# EAGLE design OMHRC (EAGLE 5.11)
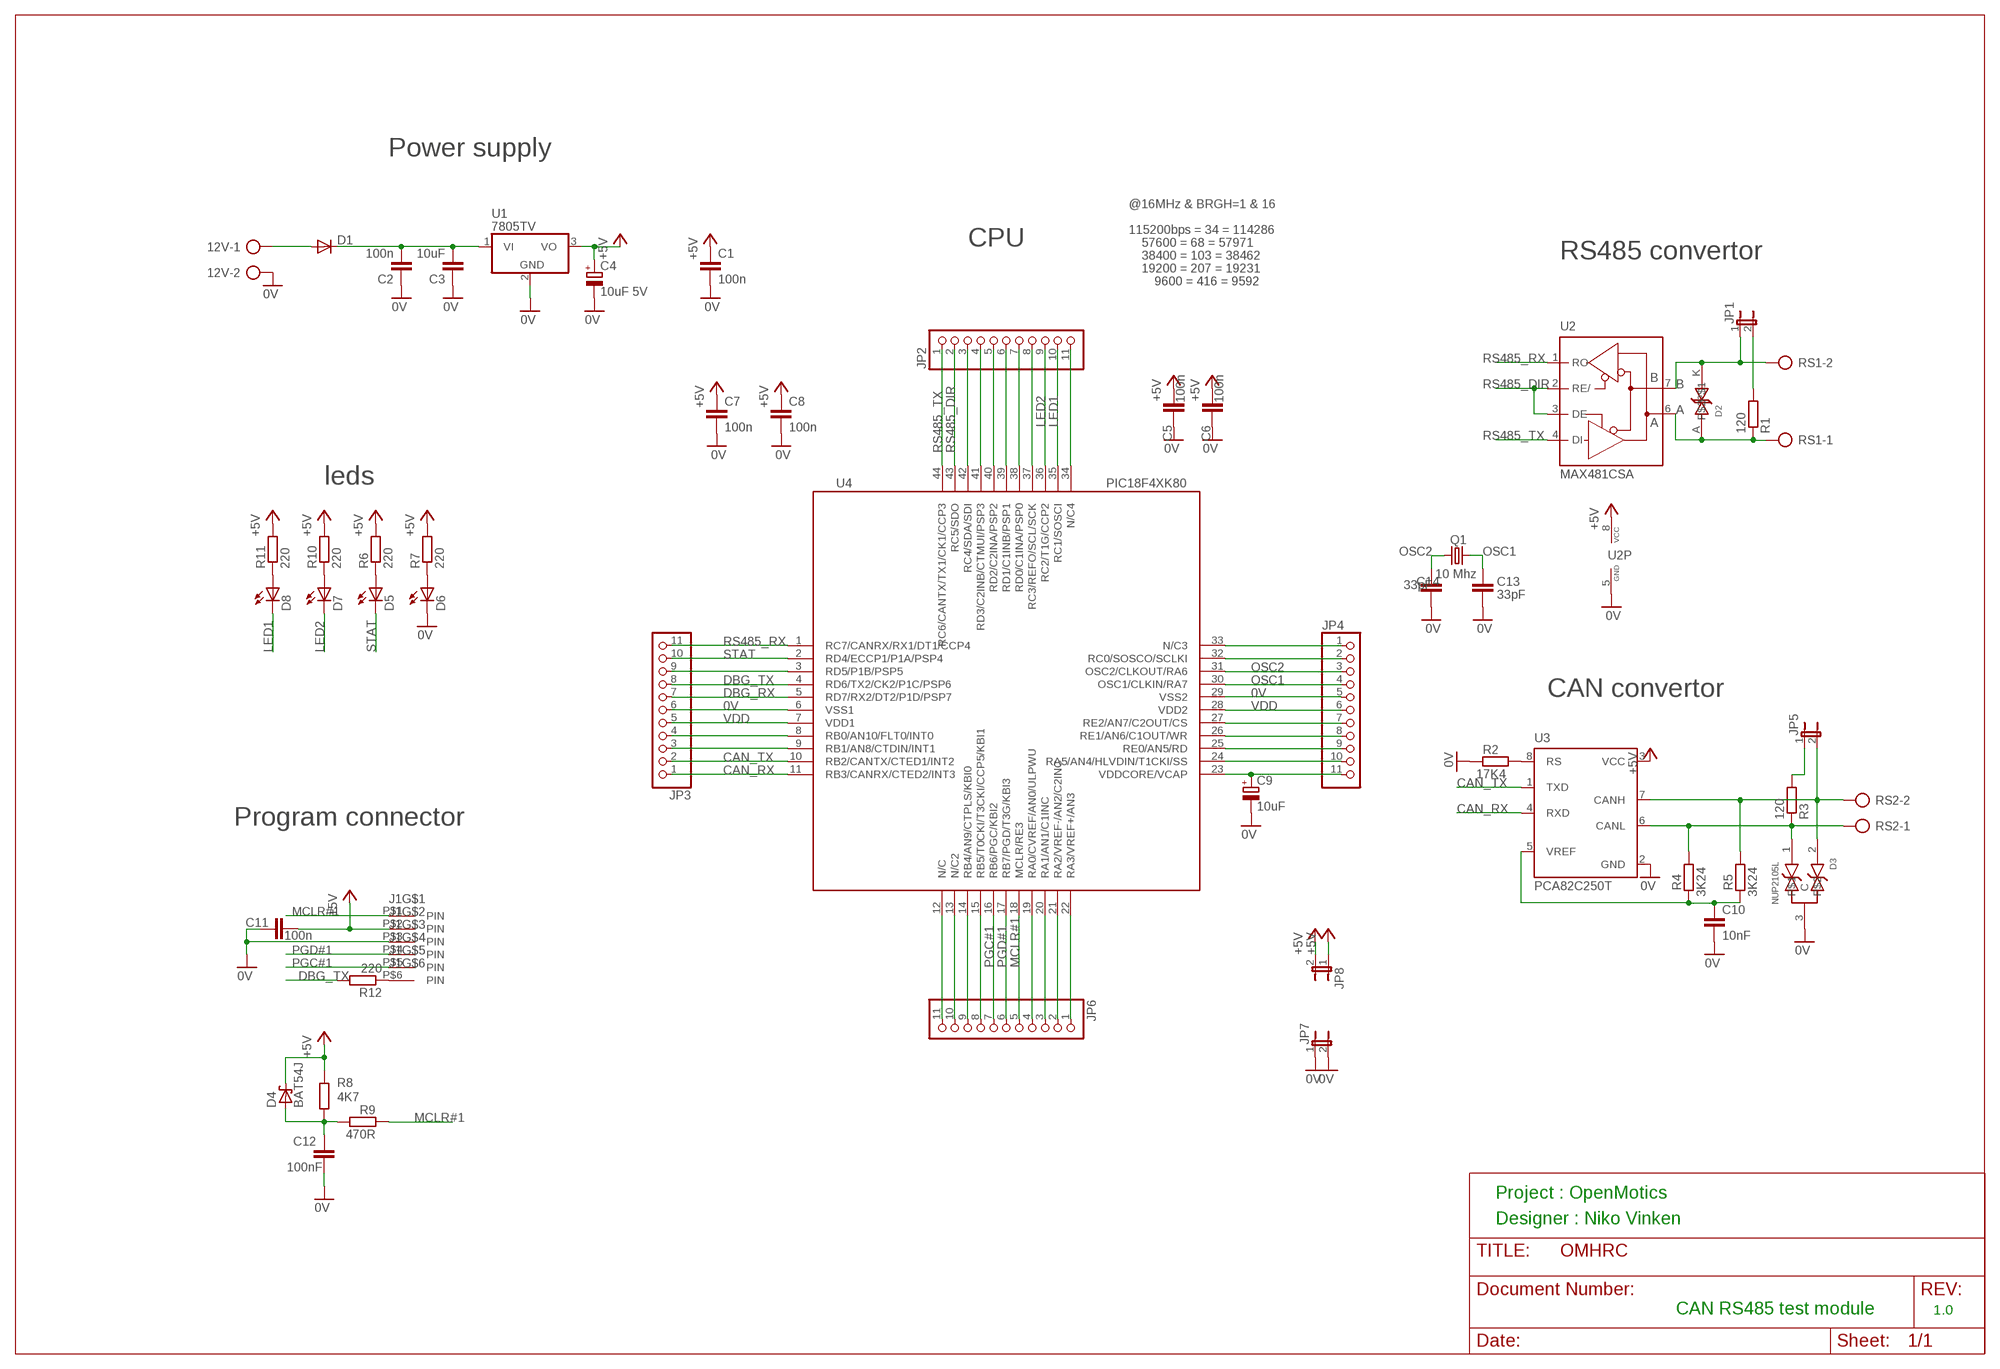
[diagram p0: schematic, sheet 1]

## Parts
12V  AK500/2  [AK500/2]
C1  100n  C-EUC0603  [C0603]
C2  100n  C-EUC0603  [C0603]
C3  10uF  C-EUC1210  [C1210]
C4  10uF 5V  CPOL-EUA/3216-18W  [A/3216-18W]
C5  100n  C-EUC0603  [C0603]
C6  100n  C-EUC0603  [C0603]
C7  100n  C-EUC0603  [C0603]
C8  100n  C-EUC0603  [C0603]
C9  10uF  CPOL-EUA/3216-18W  [A/3216-18W]
C10  10nF  C-EUC0603  [C0603]
C11  100n  C-EUC0603  [C0603]
C12  100nF  C-EUC0603  [C0603]
C13  33pF  C-EUC0603  [C0603]
C14  33pF  C-EUC0603  [C0603]
D1  DIODE-SMB  [SMB]
D2  SMAJ5.0C  [DO-214AC(SMA)]
D3  NUP2105L  [SOT23]
D4  BAT54J  [SOD323_REFLOW]
D5  LEDCHIP-LED0603  [CHIP-LED0603]
D6  LEDCHIP-LED0603  [CHIP-LED0603]
D7  LEDCHIP-LED0603  [CHIP-LED0603]
D8  LEDCHIP-LED0603  [CHIP-LED0603]
J1  6PIN_CON_AMP  [6PIN_CON_AMP]
JP1  JP1E  [JP1]
JP2  PINHD-1X11  [1X11]
JP3  PINHD-1X11  [1X11]
JP4  PINHD-1X11  [1X11]
JP5  JP1E  [JP1]
JP6  PINHD-1X11  [1X11]
JP7  JP1E  [JP1]
JP8  JP1E  [JP1]
Q1  10 Mhz  CRYSTALSM49  [SM49]
R1  120  R-EU_R0603  [R0603]
R2  17K4  R-EU_R0603  [R0603]
R3  120  R-EU_R0603  [R0603]
R4  3K24  R-EU_R0603  [R0603]
R5  3K24  R-EU_R0603  [R0603]
R6  220  R-EU_R0603  [R0603]
R7  220  R-EU_R0603  [R0603]
R8  4K7  R-EU_R0603  [R0603]
R9  470R  R-EU_R0603  [R0603]
R10  220  R-EU_R0603  [R0603]
R11  220  R-EU_R0603  [R0603]
R12  220  R-EU_R0603  [R0603]
RS1  AK500/2  [AK500/2]
RS2  AK500/2  [AK500/2]
U1  7805TV  [TO220V]
U2  MAX481CSA  [SO08]
U3  PCA82C250T  [SO8]
U4  PIC18F4XK80  [TQFP44]

## Nets
0V: 12V.2 C1.2 C2.1 C3.1 C4.- C5.2 C6.2 C7.2 C8.2 C9.- C10.2 C11.2 C12.1 C13.2 C14.2 D3.3(C) D6.C J1.P$3 JP3.6 JP4.5 JP7.1 JP7.2 R2.1 U1.2(GND) U2.5(GND) U3.2(GND) U4.6(VSS1) U4.29(VSS2)
A: D2.A R1.1 RS1.1 U2.6(A)
AAA: JP3.4 U4.8(RB0/AN10/FLT0/INT0)
B: D2.K JP1.1 RS1.2 U2.7(B)
CAN_RX: JP3.1 U3.4(RXD) U4.11(RB3/CANRX/CTED2/INT3)
CAN_TX: JP3.2 U3.1(TXD) U4.10(RB2/CANTX/CTED1/INT2)
DBG_RX: JP3.7 U4.5(RD7/RX2/DT2/P1D/PSP7)
DBG_TX: JP3.8 R12.2 U4.4(RD6/TX2/CK2/P1C/PSP6)
GFVV: JP4.8 U4.26(RE1/AN6/C1OUT/WR)
IN1: JP4.7 U4.27(RE2/AN7/C2OUT/CS)
IN2: JP2.6 U4.39(RD1/C1INB/PSP1)
IN3: JP4.2 U4.32(RC0/SOSCO/SCLKI)
IN4: JP2.7 U4.38(RD0/C1INA/PSP0)
IN5: JP6.8 U4.15(RB5/T0CKI/T3CKI/CCP5/KBI1)
IN6: JP3.9 U4.3(RD5/P1B/PSP5)
INTR: JP3.3 U4.9(RB1/AN8/CTDIN/INT1)
LED1: D8.C JP2.10 U4.35(RC1/SOSCI)
LED2: D7.C JP2.9 U4.36(RC2/T1G/CCP2)
MCLR#1: J1.P$1 JP6.5 R9.1 U4.18(MCLR/RE3)
N$1: JP2.11 U4.34(N/C4)
N$2: D7.A R10.1
N$3: C12.2 D4.2 R8.1 R9.2
N$4: JP6.1 U4.22(RA3/VREF+/AN3)
N$5: JP6.2 U4.21(RA2/VREF-/AN2/C2INC)
N$6: C2.2 C3.2 D1.C U1.1(VI)
N$7: D5.A R6.1
N$8: D6.A R7.1
N$9: 12V.1 D1.A
N$10: JP6.3 U4.20(RA1/AN1/C1INC)
N$11: JP6.4 U4.19(RA0/CVREF/AN0/ULPWU)
N$12: JP6.9 U4.14(RB4/AN9/CTPLS/KBI0)
N$13: JP6.10 U4.13(N/C2)
N$14: JP6.11 U4.12(N/C)
N$15: JP1.2 R1.2
N$16: JP4.1 U4.33(N/C3)
N$17: D3.2 JP5.2 R5.2 RS2.2 U3.7(CANH)
N$18: D3.1 R3.1 R4.2 RS2.1 U3.6(CANL)
N$19: JP4.10 U4.24(RA5/AN4/HLVDIN/T1CKI/SS)
N$20: JP5.1 R3.2
N$21: D8.A R11.1
N$22: R2.2 U3.8(RS)
N$23: J1.P$6 R12.1
N$33: C9.+ JP4.11 U4.23(VDDCORE/VCAP)
N$56: C10.1 R4.1 R5.1 U3.5(VREF)
OSC1: C13.1 JP4.4 Q1.1 U4.30(OSC1/CLKIN/RA7)
OSC2: C14.1 JP4.3 Q1.2 U4.31(OSC2/CLKOUT/RA6)
OUT2: JP2.5 U4.40(RD2/C2INA/PSP2)
OUT3: JP4.9 U4.25(RE0/AN5/RD)
OUT4: JP2.4 U4.41(RD3/C2INB/CTMUI/PSP3)
PGC#1: J1.P$5 JP6.7 U4.16(RB6/PGC/KBI2)
PGD#1: J1.P$4 JP6.6 U4.17(RB7/PGD/T3G/KBI3)
RS485_DIR: JP2.2 U2.2(RE/) U2.3(DE) U4.43(RC5/SDO)
RS485_RX: JP3.11 U2.1(RO) U4.1(RC7/CANRX/RX1/DT1/CCP4)
RS485_TX: JP2.1 U2.4(DI) U4.44(RC6/CANTX/TX1/CK1/CCP3)
SCL: JP2.8 U4.37(RC3/REFO/SCL/SCK)
SDA: JP2.3 U4.42(RC4/SDA/SDI)
STAT: D5.C JP3.10 U4.2(RD4/ECCP1/P1A/PSP4)
VDD: C1.1 C4.+ C5.1 C6.1 C7.1 C8.1 C11.1 D4.1 J1.P$2 JP3.5 JP4.6 JP8.1 JP8.2 R6.2 R7.2 R8.2 R10.2 R11.2 U1.3(VO) U2.8(VCC) U3.3(VCC) U4.7(VDD1) U4.28(VDD2) ; supply symbol labelled +5V

## Notes on the sheet
- Power supply
- @16MHz & BRGH=1 & 16
- 115200bps = 34 = 114286
- CPU | 57600 = 68 = 57971
- 38400 = 103 = 38462 | RS485 convertor
- 19200 = 207 = 19231
- 9600 = 416 = 9592
- leds
- CAN convertor
- Program connector
- Project : OpenMotics
- Designer : Niko Vinken
- CAN RS485 test module | 1.0

## Library data of the parts
12V RS1 RS2 = con-ptr500:AK500/2: CONNECTOR
C1-C3 C5-C8 C10-C14 = resistor:C-EU: CAPACITOR, European symbol
C4 C9 = resistor:CPOL-EU: POLARIZED CAPACITOR, European symbol
D1 = diode:DIODE-: DIODE
D2 = racktivity:SMAJ5.0C
D3 = OpenMotics:NUP2105L
D4 = racktivity:BAT54J
D5-D8 = led:LED: LED OSRAM: - CHIPLED LG R971, LG N971, LY N971, LG Q971, LY Q971, LO R971, LY R971 LH N974, LH R974 LS Q976, LO Q976, LY Q976 LO Q996 - Hyper CHIPLED LW Q18S LB Q993, LB Q99A, LB R99A - SideLED LS A670, LO A670, LY A670, LG A670, LP A670 LB A673, LV A673, LT A673, LW A673 LH A674 LY A675 LS A676, LA A676, LO A676, LY A676, LW A676 LS A679, LY A679, LG A679 - Hyper Micro SIDELED® LS Y876, LA Y876, LO Y876, LY Y876 LT Y87S - SmartLED LW L88C, LW L88S LB L89C, LB L89S, LG L890 LS L89K, LO L89K, LY L89K LS L896, LA L896, LO L896, LY L896 - TOPLED LS T670, LO T670, LY T670, LG T670, LP T670 LSG T670, LSP T670, LSY T670, LOP T670, LYG T670 LG T671, LOG T671, LSG T671 LB T673, LV T673, LT T673, LW T673 LH T674 LS T676, LA T676, LO T676, LY T676, LB T676, LH T676, LSB T676, LW T676 LB T67C, LV T67C, LT T67C, LS T67K, LO T67K, LY T67K, LW E67C LS E67B, LA E67B, LO E67B, LY E67B, LB E67C, LV E67C, LT E67C LW T67C LS T679, LY T679, LG T679 LS T770, LO T770, LY T770, LG T770, LP T770 LB T773, LV T773, LT T773, LW T773 LH T774 LS E675, LA E675, LY E675, LS T675 LS T776, LA T776, LO T776, LY T776, LB T776 LHGB T686 LT T68C, LB T68C - Hyper Mini TOPLED® LB M676 - Mini TOPLED Santana® LG M470 LS M47K, LO M47K, LY M47K Source: http://www.osram.convergy.de LUXEON: - LUMILED® LXK2-PW12-R00, LXK2-PW12-S00, LXK2-PW14-U00, LXK2-PW14-V00 LXK2-PM12-R00, LXK2-PM12-S00, LXK2-PM14-U00 LXK2-PE12-Q00, LXK2-PE12-R00, LXK2-PE12-S00, LXK2-PE14-T00, LXK2-PE14-U00 LXK2-PB12-K00, LXK2-PB12-L00, LXK2-PB12-M00, LXK2-PB14-N00, LXK2-PB14-P00, LXK2-PB14-Q00 LXK2-PR12-L00, LXK2-PR12-M00, LXK2-PR14-Q00, LXK2-PR14-R00 LXK2-PD12-Q00, LXK2-PD12-R00, LXK2-PD12-S00 LXK2-PH12-R00, LXK2-PH12-S00 LXK2-PL12-P00, LXK2-PL12-Q00, LXK2-PL12-R00 Source: www.luxeon.com KINGBRIGHT: KA-3528ASYC Source: www.kingbright.com
J1 = OpenMotics:6PIN_CON_AMP
JP1 JP5 JP7 JP8 = jumper:JP1E: JUMPER
JP2-JP4 JP6 = pinhead:PINHD-1X11: PIN HEADER
Q1 = crystal:CRYSTAL: CRYSTAL
R1 R3 R6-R12 = resistor:R-EU_: RESISTOR, European symbol
R2 R4 R5 = rcl:R-EU_: RESISTOR, European symbol
U1 = linear:78*: Positive VOLTAGE REGULATOR Source: http://cache.national.com/ds/LM/LM78L05.pdf http://www.fairchildsemi.com/ds/LM/LM7805.pdf
U2 = maxim:MAX481CSA: RS485 TRANSEIVER
U3 = micro-philips:PCA82C250: CAN CONTROLLER INTERFACE; OC_FARNELL: 1085275; OC_NEWARK: unknown
U4 = OpenMotics:PIC18F4XK80

## Board
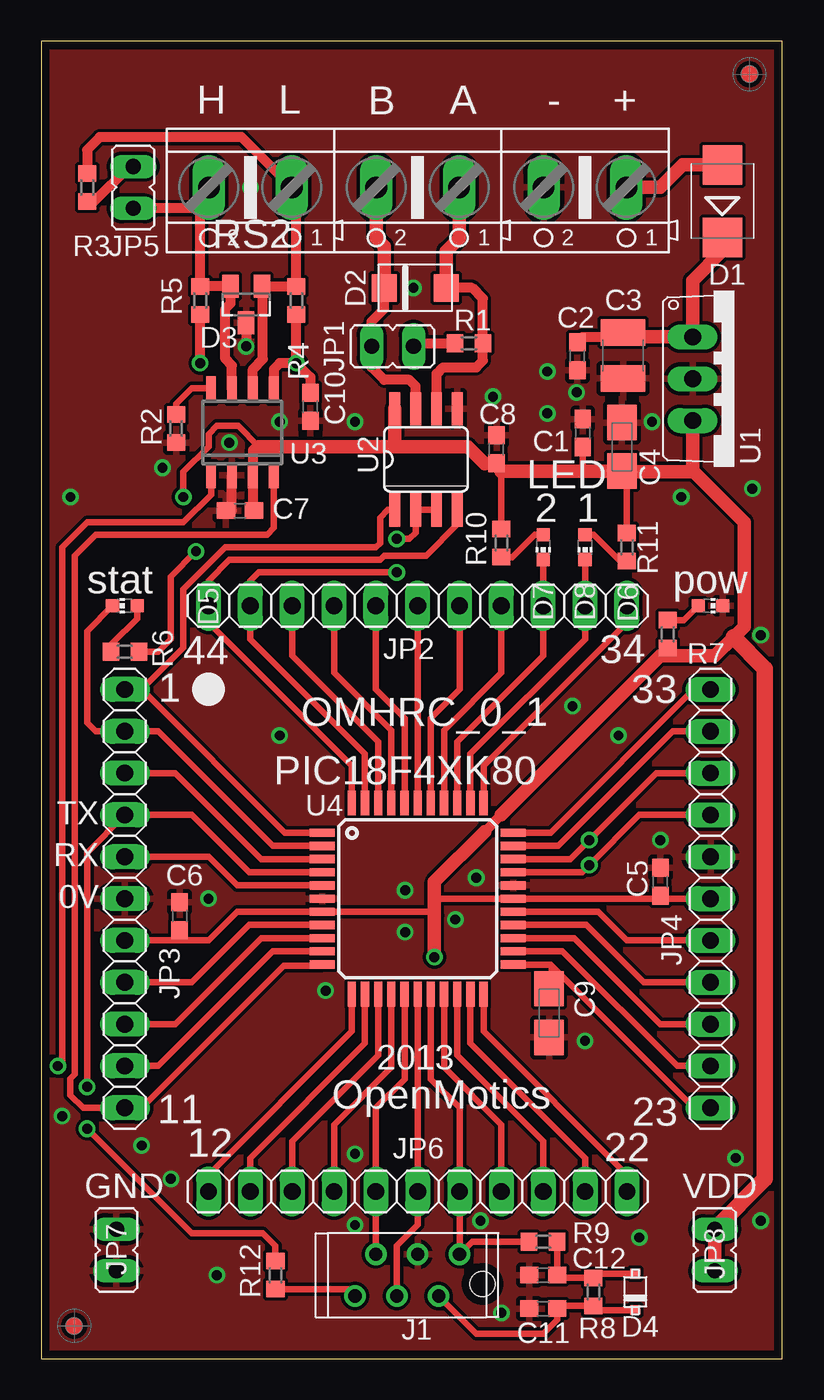
[diagram p1: board, top side]
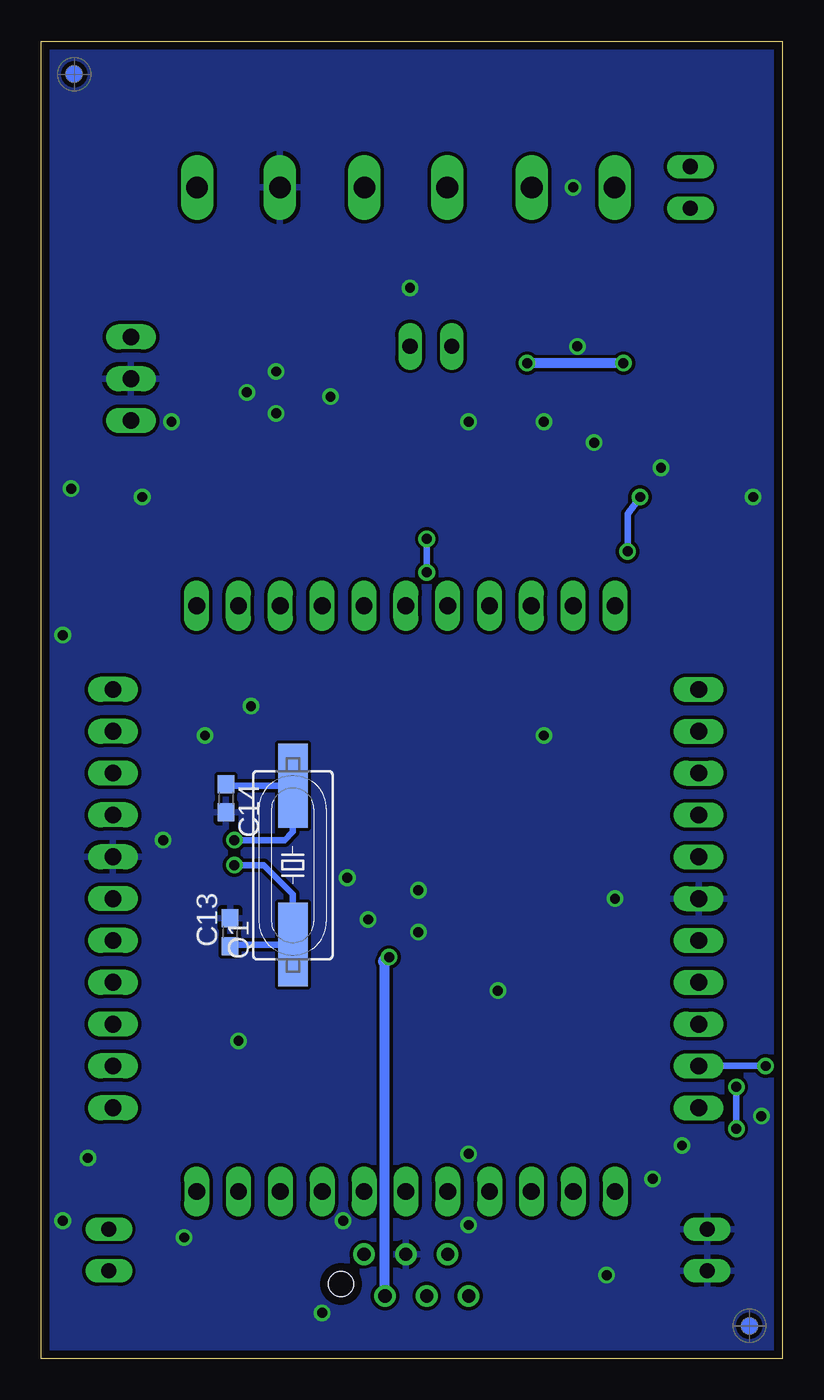
[diagram p2: board, bottom side, seen from below]

Size 45 x 80 mm. Coordinates in mm from the lower left corner, seen from the top.
Outline: 45,0 45,80 0,80 0,0 45,0
Copper layers (1+16): Top 0.035mm / dielectric 1.5mm / Bottom 0.035mm
Design rules "default *": minimum track width 10mil, minimum drill 24mil, track to track 8mil, track to pad 8mil, pad to pad 8mil, via to via 8mil, smd to smd 8mil, copper to edge 20mil, drill to drill 8mil, minimum pad ring 10mil, minimum via ring 8mil, stop-mask expansion 4mil, vias tented up to drill 0mil, thermal gap 10mil

### Footprints (pad centres in the part's own frame; a part is rotated, then mirrored left to right if it is on the bottom)
AK500/2 = drill 1.321 long: 1 -2.515,0; 2 2.515,0
C0603 = smd 1.1 x 1: 1 -0.85,0; 2 0.85,0
C1210 = smd 1.6 x 2.7: 1 -1.4,0; 2 1.4,0
A/3216-18W = smd 2.15 x 1.8: + 1.475,0; - -1.475,0
SMB = smd 2.4 x 2.4: A 2.2,0; C -2.2,0
DO-214AC(SMA) = smd 1.524 x 1.676: A 3.759,0; K 0,0
SOT23 = smd 1 x 1.4: 1 -0.95,-1.1; 2 0.95,-1.1; 3 0,1.1
SOD323_REFLOW = smd 0.6 x 0.6: 1 1.1,0; 2 -1.1,0
CHIP-LED0603 = smd 0.8 x 0.8: A 0,-0.75; C 0,0.75
6PIN_CON_AMP = drill 0.8 round: P$1 0,-1.27; P$2 1.27,1.27; P$3 2.54,-1.27; P$4 3.81,1.27; P$5 5.08,-1.27; P$6 6.35,1.27 | hole 1.5: -1.4,0.53
JP1 = drill 0.914 long: 1 0,-1.27; 2 0,1.27
1X11 = drill 1.016 long: 1 -12.7,0; 2 -10.16,0; 3 -7.62,0; 4 -5.08,0; 5 -2.54,0; 6 0,0; 7 2.54,0; 8 5.08,0; 9 7.62,0; 10 10.16,0; 11 12.7,0
SM49 = smd 5.08 x 1.778: 1 -4.826,0; 2 4.826,0
R0603 = smd 1 x 1.1: 1 -0.85,0; 2 0.85,0
TO220V = drill 1.016 long: 1 -2.54,-2.54; 2 0,-2.54; 3 2.54,-2.54
SO08 = smd 0.66 x 2.032: 1 -1.905,-3.073; 2 -0.635,-3.073; 3 0.635,-3.073; 4 1.905,-3.073; 5 1.905,3.073; 6 0.635,3.073; 7 -0.635,3.073; 8 -1.905,3.073
SO8 = smd 0.6 x 1.6: 1 -1.905,-2.6; 2 -0.635,-2.6; 3 0.635,-2.6; 4 1.905,-2.6; 5 1.905,2.6; 6 0.635,2.6; 7 -0.635,2.6; 8 -1.905,2.6
TQFP44 = smd 1.5 x 0.5: 1 -5.8,4; 2 -5.8,3.2; 3 -5.8,2.4; 4 -5.8,1.6; 5 -5.8,0.8; 6 -5.8,0; 7 -5.8,-0.8; 8 -5.8,-1.6; 9 -5.8,-2.4; 10 -5.8,-3.2; 11 -5.8,-4; 23 5.8,-4; 24 5.8,-3.2; 25 5.8,-2.4; 26 5.8,-1.6; 27 5.8,-0.8; 28 5.8,0; 29 5.8,0.8; 30 5.8,1.6; 31 5.8,2.4; 32 5.8,3.2; 33 5.8,4 | smd 0.5 x 1.5: 12 -4,-5.8; 13 -3.2,-5.8; 14 -2.4,-5.8; 15 -1.6,-5.8; 16 -0.8,-5.8; 17 0,-5.8; 18 0.8,-5.8; 19 1.6,-5.8; 20 2.4,-5.8; 21 3.2,-5.8; 22 4,-5.8; 34 4,5.8; 35 3.2,5.8; 36 2.4,5.8; 37 1.6,5.8; 38 0.8,5.8; 39 0,5.8; 40 -0.8,5.8; 41 -1.6,5.8; 42 -2.4,5.8; 43 -3.2,5.8; 44 -4,5.8

### Placement (x,y rotation side)
12V  33.02,71.12 180 top
C1  32.88,56.21 90 top
C2  32.55,60.88 90 top
C3  35.33,60.92 90 top
C4  35.26,55.37 270 top
C5  37.59,28.96 90 top
C6  8.41,26.88 90 top
C7  12.07,51.5 180 top
C8  27.65,55.22 90 top
C9  30.84,20.99 90 top
C10  16.34,57.81 270 top
C11  30.48,3.05 180 top
C12  30.48,5.08 0 top
C13  33.53,25.91 90 bottom
C14  33.78,34.04 270 bottom
D1  41.36,70.29 90 top
D2  20.83,65.02 0 top
D3  12.45,64.01 180 top
D4  36.07,4.06 270 top
D5  5.08,45.72 90 top
D6  40.64,45.72 270 top
D7  30.48,49.28 180 top
D8  33.02,49.28 180 top
J1  25.4,5.08 180 top
JP1  21.34,61.47 270 top
JP2  22.86,45.72 0 top
JP3  5.08,27.94 90 top
JP4  40.64,27.94 270 top
JP5  5.59,71.12 180 top
JP6  22.86,10.16 180 top
JP7  4.57,6.6 0 top
JP8  40.89,6.6 0 top
Q1  29.72,29.97 90 bottom
R1  25.97,61.66 180 top
R2  8.19,56.48 90 top
R3  2.79,71.12 270 top
R4  15.49,64.26 90 top
R5  9.65,64.26 90 top
R6  5.08,42.93 0 top
R7  38.04,44 270 top
R8  33.53,4.06 270 top
R9  30.48,7.11 0 top
R10  27.94,49.53 90 top
R11  35.56,49.28 90 top
R12  14.22,5.08 90 top
RS1  22.86,71.12 180 top
RS2  12.7,71.12 180 top
U1  42.09,59.5 270 top
U2  23.37,54.61 0 top
U3  12.22,56.25 0 top
U4  22.86,27.94 0 top
U$1  [FIDUCIAL_G10]  43,78 0 top
U$2  [FIDUCIAL_G10]  2,2 0 top
U$3  [FIDUCIAL_G10]  2,2 0 bottom
U$12  [FIDUCIAL_G10]  43,78 0 bottom

### Tracks (layer width: path | path; a pad name or v marks a point on that pad's centre or on a via)
0V  (via drill 0.6)
  Top 0.406: C6.2 8.43,27.73 8.64,27.94
  Top 0.61: D3.3 v12.45,61.47 | U3.2 11.58,51.49 C7.2
  Top 0.813: 35.26,59.46 C3.1 35.34,59.5
  other vias: 14.48,56.9 7.37,54.1 27.43,58.42 30.73,59.94 30.73,57.4 32.51,58.67 37.08,56.9 38.86,52.32 37.59,31.5 22.1,28.45 22.1,25.91 25.15,26.67 26.42,29.21 33.02,19.3 10.16,27.94 27.94,2.79 1.27,14.73 14.48,37.85 11.43,55.63 26.67,8.38 19.05,8.13 19.05,12.45 43.18,52.83 43.69,43.94 35.05,37.85 32.26,39.62 6.1,12.95 7.87,10.92 42.16,12.19 43.69,8.38 36.32,7.37 10.67,5.08 17.27,22.35 1.78,52.32 12.7,71.12 22.61,65.02 19.05,56.9
  pour Top: 0,0 0,80.01 45.21,80.01 45.21,0
  pour Bottom: 0,0 0,80.01 45.21,80.01 45.21,0
A
  Top 0.61: U2.6 24,59.82 24.38,60.2 26.42,60.2 26.82,60.6 R1.1 26.82,64.37 26.16,65.02 D2.A
  Top 0.813: RS1.1 25.38,68.05 24.59,67.26 D2.A
AAA
  Top 0.406: U4.8 12.62,26.34 9.14,22.86 JP3.4
B
  Top 0.61: D2.K 20.83,63.75 20.07,62.99 JP1.1 20.07,60.2 20.83,59.44 22.35,59.44 22.73,59.05 U2.7
  Top 0.813: RS1.2 20.34,68.05 20.83,67.56 D2.K
CAN_RX
  Top 0.406: U4.11 17,23.88 14.73,23.88 6.1,15.24 JP3.1 2.54,15.24 1.78,16 1.78,17.02 2.03,17.27 2.03,48.77 3.3,50.04 13.72,50.04 14.12,50.44 U3.4
CAN_TX  (via drill 0.6)
  Top 0.406: U4.10 14.07,24.74 7.11,17.78 JP3.2 | U3.1 10.31,52.48 8.64,50.8 2.79,50.8 1.27,49.28 1.27,18.03 v1.02,17.78
  Bottom 0.406: v1.02,17.78 JP3.2
DBG_RX
  Top 0.406: U4.5 11.9,28.74 10.16,30.48 JP3.7
DBG_TX  (via drill 0.6)
  Top 0.406: U4.4 12.62,29.54 9.14,33.02 JP3.8 2.79,30.73 v2.79,16.51 | v2.79,13.97 9.14,7.62 13.46,7.62 14.22,6.86 R12.2
  Bottom 0.406: v2.79,13.97 v2.79,16.51
GFVV
  Top 0.406: JP4.8 36.58,22.86 33.1,26.34 U4.26
IN1
  Top 0.406: JP4.7 35.56,25.4 33.82,27.14 U4.27
IN2
  Top 0.406: U4.39 JP2.6
IN3
  Top 0.406: U4.32 31.39,31.14 38.35,38.1 JP4.2
IN4
  Top 0.406: U4.38 23.66,38.9 25.4,40.64 JP2.7
IN5
  Top 0.406: JP6.8 17.78,14.22 21.26,17.7 U4.15
IN6
  Top 0.406: U4.3 13.35,30.34 8.13,35.56 JP3.9
INTR
  Top 0.406: U4.9 13.35,25.54 8.13,20.32 JP3.3
LED1
  Top 0.406: U4.35 26.06,36.73 33.02,43.69 JP2.10 D8.C
LED2
  Top 0.406: U4.36 25.26,37.45 30.48,42.67 JP2.9 D7.C
MCLR#1
  Top 0.406: U4.18 23.66,16.98 25.4,15.24 JP6.5 J1.P$1 26.16,7.11 R9.1
N$1
  Top 0.406: U4.34 26.86,36 35.56,44.7 JP2.11
N$2
  Top 0.406: R10.1 28.61,48.68 29.97,50.04 30.47,50.04 D7.A
N$3
  Top 0.406: R9.2 C12.2 31.5,4.91 R8.1 33.78,5.16 D4.2
N$4
  Top 0.406: JP6.1 35.56,11.18 26.86,19.88 U4.22
N$5
  Top 0.406: JP6.2 33.02,12.19 26.06,19.15 U4.21
N$6
  Top 0.61: C2.2 32.86,62.04 35.81,62.04
  Top 0.813: C3.2 35.6,62.04 35.81,62.04 U1.1 39.55,65.46 41.36,67.27 D1.C
N$7
  Top 0.406: D5.A 5.83,44.95 4.32,43.43 4.32,43.01 R6.1
N$8
  Top 0.406: R7.1 39.02,44.85 D6.A
N$9
  Top 0.813: D1.A 38.97,72.5 37.59,71.12 12V.1
N$10
  Top 0.406: JP6.3 30.48,13.21 25.26,18.43 U4.20
N$11
  Top 0.406: JP6.4 27.94,14.22 24.46,17.7 U4.19
N$12
  Top 0.406: JP6.9 15.24,13.21 20.46,18.43 U4.14
N$13
  Top 0.406: JP6.10 12.7,12.19 19.66,19.15 U4.13
N$14
  Top 0.406: JP6.11 10.16,11.18 18.86,19.88 U4.12
N$15
  Top 0.61: JP1.2 22.79,61.66 R1.2
N$16
  Top 0.406: U4.33 30.92,31.94 39.62,40.64 JP4.1 41.15,40.64
N$17
  Top 0.61: D3.2 11.62,65.11 | 9.65,69.85 R5.2 D3.2 | 9.65,69.85 9.65,70.59 RS2.2 | D3.2 11.5,64.07 11.18,63.75 11.18,60.71 11.58,60.3 U3.7 | 9.65,69.85 JP5.2
N$18
  Top 0.61: U3.6 12.85,60.1 13.46,60.71 13.46,65.04 D3.1 R4.2 15.49,70.84 RS2.1 12.17,74.17 3.56,74.17 2.79,73.41 R3.1
N$19
  Top 0.406: JP4.10 38.61,17.78 31.65,24.74 U4.24
N$20
  Top 0.61: R3.2 3.21,70.27 5.33,72.39 JP5.1
N$21
  Top 0.406: D8.A 33.54,50.03 35.31,48.26 R11.1
N$22
  Top 0.406: R2.2 8.19,57.98 9.14,58.93 10.23,58.93 U3.8
N$23
  Top 0.406: R12.1 18.63,4.23 J1.P$6
N$33
  Top 0.406: JP4.11 39.62,15.24 30.99,23.88 | 30.99,23.88 30.92,23.94 U4.23 | C9.+ 30.99,22.61 30.99,23.88
N$56  (via drill 0.6)
  Top 0.61: U3.5 14.12,60.1 14.48,60.45 v15.49,60.45 | v15.49,60.45 R4.1 | v9.65,60.45 R5.1 | C10.1 16.34,59.6 v15.49,60.45
  Bottom 0.61: v9.65,60.45 v15.49,60.45
OSC1  (via drill 0.6)
  Top 0.406: U4.30 32.84,29.54 v33.27,29.97 36.32,33.02 JP4.4
  Bottom 0.406: v33.27,29.97 31.5,29.97 29.72,28.19 Q1.1 33.44,25.15 C13.1
OSC2  (via drill 0.6)
  Top 0.406: JP4.3 37.34,35.56 v33.27,31.5 32.12,30.34 U4.31
  Bottom 0.406: v33.27,31.5 30.23,31.5 29.72,32 Q1.2 33.69,34.8 C14.1
OUT2
  Top 0.406: U4.40 22.06,38.9 20.32,40.64 JP2.5
OUT3
  Top 0.406: JP4.9 37.59,20.32 32.37,25.54 U4.25
OUT4
  Top 0.406: U4.41 21.26,38.18 17.78,41.66 JP2.4
PGC#1
  Top 0.406: U4.16 22.06,16.98 20.32,15.24 JP6.7 J1.P$5
PGD#1
  Top 0.406: U4.17 JP6.6 22.86,8.13 21.59,6.86 J1.P$4
RS485_DIR  (via drill 0.6)
  Top 0.406: U2.3 U2.2 22.73,50.16 22.35,49.78 v21.59,49.78 | U4.43 19.66,36.73 12.7,43.69 JP2.2 12.7,47.24 13.21,47.75 v21.59,47.75
  Bottom 0.406: v21.59,47.75 v21.59,49.78
RS485_RX
  Top 0.406: U4.1 14.8,31.94 6.1,40.64 | 6.1,40.64 JP3.11 | 6.1,40.64 8.64,43.18 8.64,46.74 11.18,49.28 20.32,49.28 20.57,49.53 20.57,51.05 21.06,51.54 U2.1
RS485_TX
  Top 0.406: U2.4 25.27,50.67 23.37,48.77 20.83,48.77 20.57,48.51 11.43,48.51 10.16,47.24 JP2.1 10.16,44.7 18.86,36 U4.44
SCL
  Top 0.406: U4.37 24.46,38.18 27.94,41.66 JP2.8
SDA
  Top 0.406: U4.42 20.46,37.45 15.24,42.67 JP2.3
STAT
  Top 0.406: U4.2 14.07,31.14 7.11,38.1 JP3.10 3.3,38.1 2.79,38.61 2.79,44.18 D5.C
VDD  (via drill 0.6)
  Top 0.406: 37.59,27.94 U4.28 23.88,27.94 | 37.59,27.94 JP4.6 | 8.64,25.4 JP3.5 | 8.64,25.4 10.16,25.4 11.9,27.14 U4.7 23.66,27.14 23.88,26.92 | D4.1 33.53,2.96 R8.2 31.5,3.21 C11.1 31.33,2.37 30.48,1.52 26.42,1.52 J1.P$2 | C6.1 8.41,25.63 8.64,25.4 | 37.59,27.94 C5.1 | C1.1 32.88,54.03 33.02,53.89 | v9.4,49.02 7.87,47.5 7.87,43.69 7.11,42.93 R6.2 | v8.64,52.32 8.64,53.85 10.16,55.37 10.16,56.13 10.67,56.64 11.96,56.64 13.22,55.39 | 36.02,53.89 C4.+ 35.56,53.59 R11.2 | R10.2 27.94,53.85 27.94,54.08 C8.1
  Top 0.61: 26.92,32 27.94,33.02 | C7.1 12.85,51.56 U3.3 12.85,55.02 12.95,55.12 | 37.79,42.67 R7.2
  Top 0.813: v23.88,24.38 23.88,26.92 23.88,27.94 23.88,28.96 26.92,32 | 27.94,33.02 37.59,42.67 37.79,42.67 40.89,42.67 42.04,43.81 42.67,44.45 42.67,50.8 39.62,53.85 | 39.62,53.85 35.31,53.85 C4.+ 33.02,53.89 27.99,53.89 27.94,53.85 | U1.3 39.55,53.92 39.62,53.85 | C8.1 26.92,54.36 25.89,55.39 21.34,55.39 | U2.8 21.46,55.51 21.34,55.39 | 21.34,55.39 13.22,55.39 12.95,55.12 | JP8.2 JP8.1
  Top 1.016: JP8.2 43.94,10.92 43.94,41.91 42.04,43.81
  Bottom 0.406: v9.4,49.02 9.4,51.31 v8.64,52.32
  Bottom 0.61: J1.P$2 24.13,24.13
  Bottom 0.813: 24.13,24.13 v23.88,24.38

### Text on the board
tNames: H | L | B | A | - | + | LED | 2 | 1 | stat | pow | 44 | 34 | 1 | 33 | OMHRC_0_1 | PIC18F4XK80 | TX | RX | 0V | 2013 | OpenMotics | 11 | 23 | 12 | 22 | GND | VDD